# EAGLE schematic QC_v0_1 (EAGLE 5.10)
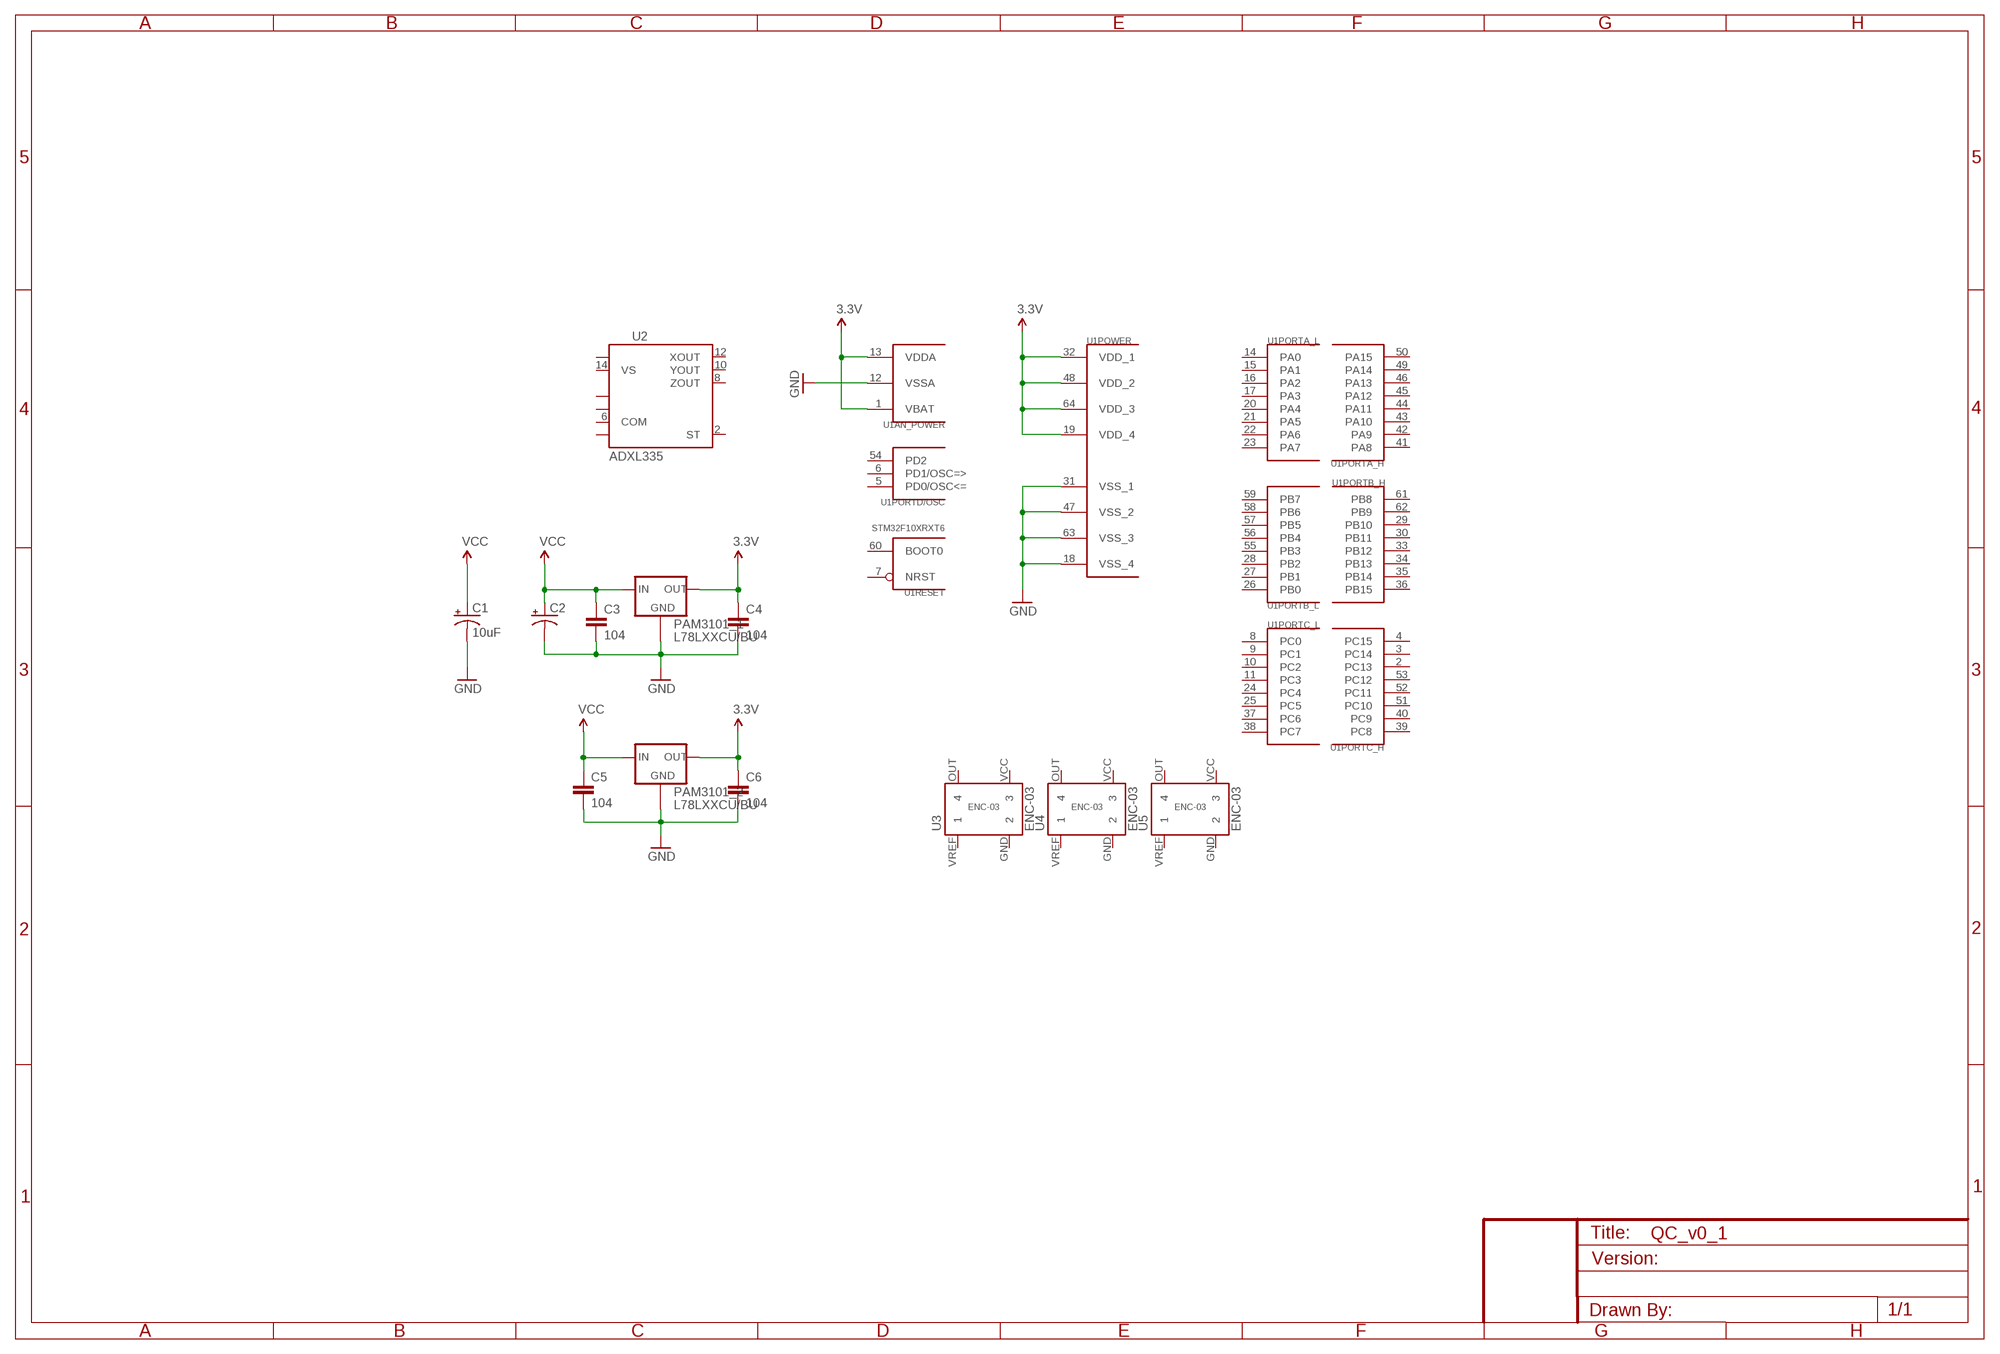
[diagram p0: schematic, sheet 1]

## Parts
C1  10uF  CAP_POL3528  [EIA3528]
C2  CAP_POL3528  [EIA3528]
C3  104  CAP0603-CAP  [0603-CAP]
C4  104  CAP0603-CAP  [0603-CAP]
C5  104  CAP0603-CAP  [0603-CAP]
C6  104  CAP0603-CAP  [0603-CAP]
PAM3101_1  L78LXXCU/BU  [SOT89]
PAM3101_2  L78LXXCU/BU  [SOT89]
U1  STM32F10XRXT6  [TQFP64]
U2  ADXL335  [LFCSP-16]
U3  ENC-03S  [ENC-03]
U4  ENC-03S  [ENC-03]
U5  ENC-03S  [ENC-03]

## Nets
3.3V: C4.1 C6.1 PAM3101_1.1(OUT) PAM3101_2.1(OUT) U1.1(AN_POWER:VBAT) U1.13(AN_POWER:VDDA) U1.19(POWER:VDD_4) U1.32(POWER:VDD_1) U1.48(POWER:VDD_2) U1.64(POWER:VDD_3)
GND: C1.C(-) C2.C(-) C3.2 C4.2 C5.2 C6.2 PAM3101_1.4(GND1) PAM3101_2.4(GND1) U1.12(AN_POWER:VSSA) U1.18(POWER:VSS_4) U1.31(POWER:VSS_1) U1.47(POWER:VSS_2) U1.63(POWER:VSS_3)
VCC: C1.A(+) C2.A(+) C3.1 C5.1 PAM3101_1.3(IN) PAM3101_2.3(IN)
Unconnected: PAM3101_1.2(GND) PAM3101_2.2(GND) U1.2(PORTC_H:PC13) U1.3(PORTC_H:PC14) U1.4(PORTC_H:PC15) U1.5(PORTD/OSC:PD0/OSC<=) U1.6(PORTD/OSC:PD1/OSC=>) U1.7(RESET:NRST) U1.8(PORTC_L:PC0) U1.9(PORTC_L:PC1) U1.10(PORTC_L:PC2) U1.11(PORTC_L:PC3) U1.14(PORTA_L:PA0) U1.15(PORTA_L:PA1) U1.16(PORTA_L:PA2) U1.17(PORTA_L:PA3) U1.20(PORTA_L:PA4) U1.21(PORTA_L:PA5) U1.22(PORTA_L:PA6) U1.23(PORTA_L:PA7) U1.24(PORTC_L:PC4) U1.25(PORTC_L:PC5) U1.26(PORTB_L:PB0) U1.27(PORTB_L:PB1) U1.28(PORTB_L:PB2) U1.29(PORTB_H:PB10) U1.30(PORTB_H:PB11) U1.33(PORTB_H:PB12) U1.34(PORTB_H:PB13) U1.35(PORTB_H:PB14) U1.36(PORTB_H:PB15) U1.37(PORTC_L:PC6) U1.38(PORTC_L:PC7) U1.39(PORTC_H:PC8) U1.40(PORTC_H:PC9) U1.41(PORTA_H:PA8) U1.42(PORTA_H:PA9) U1.43(PORTA_H:PA10) U1.44(PORTA_H:PA11) U1.45(PORTA_H:PA12) U1.46(PORTA_H:PA13) U1.49(PORTA_H:PA14) U1.50(PORTA_H:PA15) U1.51(PORTC_H:PC10) U1.52(PORTC_H:PC11) U1.53(PORTC_H:PC12) U1.54(PORTD/OSC:PD2) U1.55(PORTB_L:PB3) U1.56(PORTB_L:PB4) U1.57(PORTB_L:PB5) U1.58(PORTB_L:PB6) U1.59(PORTB_L:PB7) U1.60(RESET:BOOT0) U1.61(PORTB_H:PB8) U1.62(PORTB_H:PB9) U2.2(ST) U2.3(COM) U2.5(COM) U2.6(COM) U2.7(COM) U2.8(ZOUT) U2.10(YOUT) U2.12(XOUT) U2.14(VS) U2.15(VS) U3.GND U3.OUT U3.VREF U4.GND U4.OUT U4.VREF U5.GND U5.OUT U5.VREF

## Power pins joined to a net without a drawn wire
3: U3.VCC U4.VCC U5.VCC

## Library data of the parts
C1 C2 = SparkFun:CAP_POL: Capacitor Polarized These are standard SMD and PTH capacitors. Normally 10uF, 47uF, and 100uF in electrolytic and tantalum varieties. Always verify the external diameter of the through hole cap, it varies with capacity, voltage, and manufacturer. The EIA devices should be standard.
C3-C6 = SparkFun:CAP: Capacitor Standard 0603 ceramic capacitor, and 0.1" leaded capacitor.
PAM3101_1 PAM3101_2 = v-reg-3:L78LXXCU/BU: VOLTAGE REGULATOR
U1 = stm32:STM32F10XRXT6: STM32F101/103 64pin LQFP
U2 = SparkFun:ADXL335
U3-U5 = ENC-03R:ENC-03: ENC-03<2>